# Altium project LSEL_PCB.PrjPcb
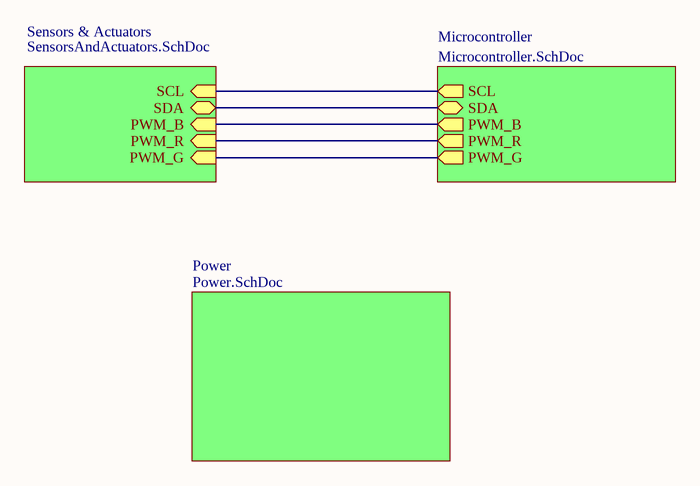
[diagram p0: General.SchDoc]
Project: LSEL PCB
4 sheets, 31 parts. Net scope: hierarchical (ports join the sheet entries above them; power ports are global).
Board file: LSEL_PCB.PcbDoc
Sheets:
  General.SchDoc
    Power = Power.SchDoc
    Microcontroller = Microcontroller.SchDoc
    Sensors & Actuators = SensorsAndActuators.SchDoc

## Sheet General.SchDoc
size A4; Date: *******; ApprovedBy: *******; CheckedBy: Dora; Author: *******; CompanyName: *******; DrawnBy: Loreto y Marcos; Engineer: *******; Organization: *******; Address1: *******; Address2: *******; Address3: *******; Address4: *******; DocumentNumber: 1; Revision: *******; SheetNumber: 1; SheetTotal: 4; CurrentTime: *******; CurrentDate: *******; Time: *******; DocumentFullPathAndName: *******; DocumentName: *******; ModifiedDate: *******; ImagePath: *******; ProjectName: *******; Application_BuildNumber: *******

### Sub-sheets
Microcontroller = Microcontroller.SchDoc: PWM_B (out), PWM_G (out), SDA (bidir), SCL (out), PWM_R (out)
Power = Power.SchDoc: no entries
Sensors & Actuators = SensorsAndActuators.SchDoc: SDA (bidir), PWM_B (in), SCL (in), PWM_R (in), PWM_G (in)

### Nets
NetR41_1: sheet Microcontroller/SDA, sheet Sensors & Actuators/SDA
NetR42_1: sheet Microcontroller/SCL, sheet Sensors & Actuators/SCL
NetR43_2: sheet Microcontroller/PWM_B, sheet Sensors & Actuators/PWM_B
NetR44_2: sheet Microcontroller/PWM_R, sheet Sensors & Actuators/PWM_R
NetR45_2: sheet Microcontroller/PWM_G, sheet Sensors & Actuators/PWM_G

### Notes on the sheet
- Title:
- Drawn By:
- Page Contents:
- Checked By:
- Size:
- Date:
- File:
- License:
- Email:
- A4
- Number:
- Time:
- Revision:
- Sheet
- Website:
- of

## Sheet Power.SchDoc
size A4; Date: *******; ApprovedBy: *******; CheckedBy: None; Author: *******; CompanyName: *******; DrawnBy: Name; Engineer: *******; Organization: *******; Address1: *******; Address2: *******; Address3: *******; Address4: *******; DocumentNumber: Doc Num; Revision: *******; SheetNumber: 2; SheetTotal: 4; CurrentTime: *******; CurrentDate: *******; Time: *******; DocumentFullPathAndName: *******; DocumentName: *******; ModifiedDate: *******; ImagePath: *******; ProjectName: *******; Application_BuildNumber: *******
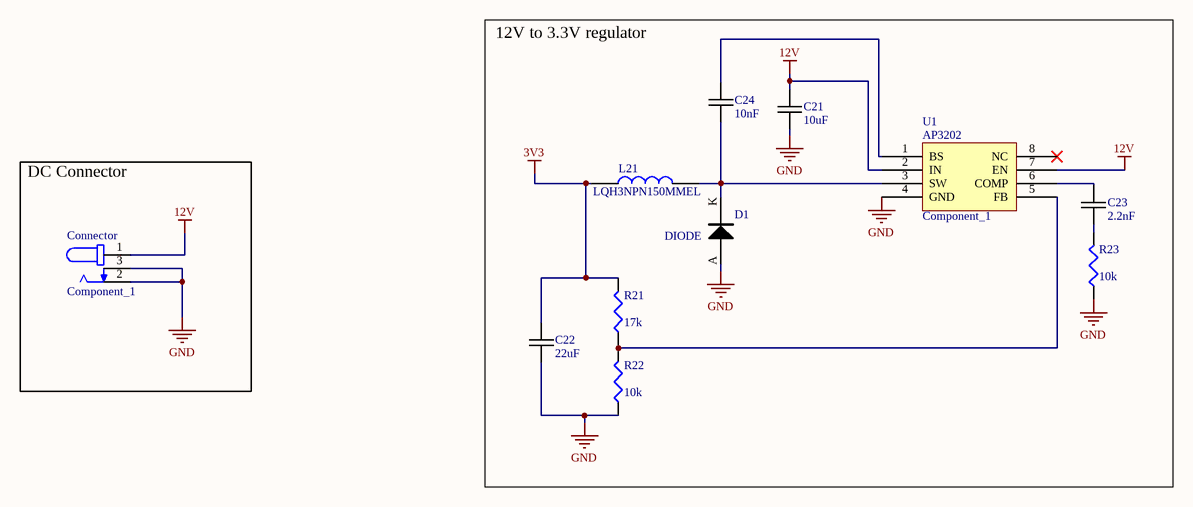
[diagram p1: Power.SchDoc]

### Parts
C21  10uF  [0603C-GENERIC]
C22  22uF  [0603C-GENERIC]
C23  2.2nF  [0603C-GENERIC]
C24  10nF  [0603C-GENERIC]
Connector  Component_1  [PCBComponent_1]
D1  DIODE  [RESC2012X65N]
L21  LQH3NPN150MMEL  [IND_LQH3NPH3R3MMEL]
R21  value 17k  [J1-0603]
R22  value 10k  [J1-0603]
R23  value 10k  [J1-0603]
U1  Component_1  [AP3202]

### Blocks framed on the sheet
12V to 3.3V regulator: C21-C24 D1 L21 R21-R23 U1
DC Connector: Connector

### Nets
3V3: C22.1 L21.1 R21.2
12V: C21.1 Connector.1 U1.2(IN) U1.7(EN)
GND: C21.2 C22.2 Connector.2 Connector.3 D1.A R22.1 R23.1 U1.4(GND)
NetC23_1: C23.1 U1.6(COMP)
NetC23_2: C23.2 R23.2
NetC24_1: C24.1 U1.1(BS)
NetC24_2: C24.2 D1.K L21.2 U1.3(SW)
NetR21_1: R21.1 R22.2 U1.5(FB)

Not connected (* = marked no-connect by the designer): U1 8(NC)*

### Notes on the sheet
- Title:
- Drawn By:
- Page Contents:
- Checked By:
- Size:
- Date:
- File:
- License:
- Email:
- A4
- Number:
- Time:
- Revision:
- Sheet
- Website:
- of
- (in symbol Component_1) AP3202

### Library data of the parts
C21-C24 = C0603-GENERIC: GENERIC CAPACITOR NON POLARISED 0603
D1 = DIODE-GENERIC: GENERIC DIODE
L21 = LQH3NPH3R3MMEL: Inductor with Inductance 3.3uH Tol.+/-20% Package 1212 (3030); MF: Murata; Check_prices: https://www.snapeda.com/parts/LQH3NPH3R3MMEL/Murata/view-part/4970388/?ref=eda; Digi-Key_Part_Number: 490-LQH3NPH3R3MMELCT-ND; Package: 1212 Murata; MP: LQH3NPH3R3MMEL; Value: *; SnapEDA_Link: https://www.snapeda.com/parts/LQH3NPH3R3MMEL/Murata/view-part/4970388/?ref=snap; Purchase-URL: https://pricing.snapeda.com/search/part/LQH3NPH3R3MMEL/?ref=eda
R21-R23 = Res3: Resistor; Published: 8-Jun-2000; LatestRevisionDate: 29-May-2009; LatestRevisionNote: IPC-7351 Footprint Added.; PackageReference: J1-0603; Publisher: Altium Limited; PackageDescription: Chip Resistor

## Sheet Microcontroller.SchDoc: Title
size A4; Date: *******; ApprovedBy: *******; CheckedBy: None; Author: *******; CompanyName: *******; DrawnBy: Name; Engineer: *******; Organization: *******; Address1: *******; Address2: *******; Address3: *******; Address4: *******; DocumentNumber: Doc Num; Revision: *******; SheetNumber: 3; SheetTotal: 4; CurrentTime: *******; CurrentDate: *******; Time: *******; DocumentFullPathAndName: *******; DocumentName: *******; ModifiedDate: *******; ImagePath: *******; ProjectName: *******; Application_BuildNumber: *******
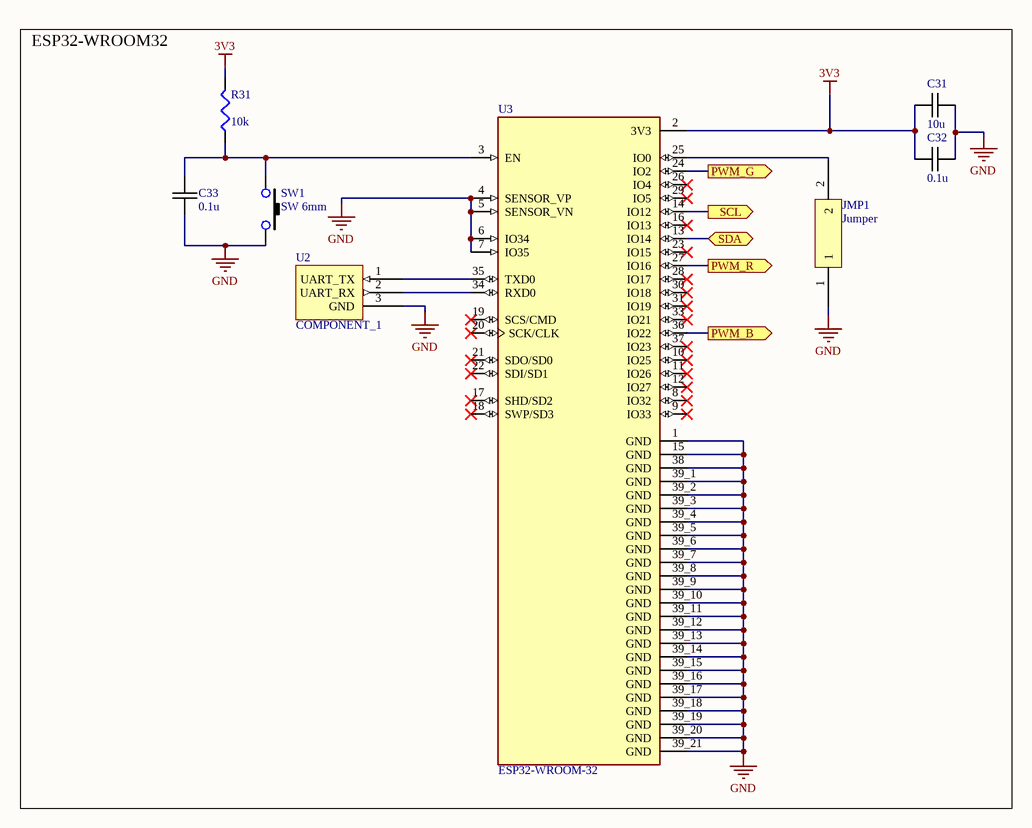
[diagram p2: Microcontroller.SchDoc]

### Parts
C31  10u  [0603C-GENERIC]
C32  0.1u  [0603C-GENERIC]
C33  0.1u  [0603C-GENERIC]
JMP1  Jumper  [jumper]
R31  value 10k  [J1-0603]
SW1  SW 6mm  [SW-PB-SMD]
U2  COMPONENT_1  [PCBComponent_1]
U3  ESP32-WROOM-32  [ESP32]

### Blocks framed on the sheet
ESP32-WROOM32: C31-C33 JMP1 R31 SW1 U2 U3

### Ports
PWM_B (out), PWM_G (out), PWM_R (out), SCL (out), SDA (bidir)

### Nets
3V3: C31.1 C32.1 R31.2 U3.2(3V3)
GND: C31.2 C32.2 C33.2 JMP1.1 SW1.2 U2.3(GND) U3.1(GND) U3.4(SENSOR_VP) U3.5(SENSOR_VN) U3.6(IO34) U3.7(IO35) U3.15(GND) U3.38(GND) U3.39_1(GND) U3.39_2(GND) U3.39_3(GND) U3.39_4(GND) U3.39_5(GND) U3.39_6(GND) U3.39_7(GND) U3.39_8(GND) U3.39_9(GND) U3.39_10(GND) U3.39_11(GND) U3.39_12(GND) U3.39_13(GND) U3.39_14(GND) U3.39_15(GND) U3.39_16(GND) U3.39_17(GND) U3.39_18(GND) U3.39_19(GND) U3.39_20(GND) U3.39_21(GND)
NetC33_1: C33.1 R31.1 SW1.1 U3.3(EN)
NetJMP1_2: JMP1.2 U3.25(IO0)
NetR41_1: U3.13(IO14) ; port SDA
NetR42_1: U3.14(IO12) ; port SCL
NetR43_2: U3.36(IO22) ; port PWM_B
NetR44_2: U3.27(IO16) ; port PWM_R
NetR45_2: U3.24(IO2) ; port PWM_G
NetU2_1: U2.1(UART_TX) U3.35(TXD0)
NetU2_2: U2.2(UART_RX) U3.34(RXD0)

Not connected (* = marked no-connect by the designer): U3 8(IO32)* 9(IO33)* 10(IO25)* 11(IO26)* 12(IO27)* 16(IO13)* 17(SHD/SD2)* 18(SWP/SD3)* 19(SCS/CMD)* 20(SCK/CLK)* 21(SDO/SD0)* 22(SDI/SD1)* 23(IO15)* 26(IO4)* 28(IO17)* 29(IO5)* 30(IO18)* 31(IO19)* 33(IO21)* 37(IO23)*

### Notes on the sheet
- Title:
- Drawn By:
- Page Contents:
- Checked By:
- Size:
- Date:
- File:
- License:
- Email:
- A4
- Number:
- Time:
- Revision:
- Sheet
- Website:
- of

### Library data of the parts
C31-C33 = C0603-GENERIC: GENERIC CAPACITOR NON POLARISED 0603
R31 = Res3: Resistor; Published: 8-Jun-2000; LatestRevisionDate: 29-May-2009; LatestRevisionNote: IPC-7351 Footprint Added.; PackageReference: J1-0603; Publisher: Altium Limited; PackageDescription: Chip Resistor
SW1 = SW-PB6MM-SMD: PUSHBUTTON SWITCH 6MM SMD
U3 = ESP32-WROOM-32: Bluetooth, WiFi Transceiver Module 2.4GHz ~ 2.5GHz Surface Mount; MF: Espressif Systems; Package: Module Espressif Systems; Digi-Key_Part_Number: 1904-1010-1-ND; Digi-Key_Purchase_URL: https://www.digikey.com/product-detail/en/espressif-systems/ESP32-WROOM-32/1904-1010-1-ND/8544305?utm_source=snapeda&utm_medium=aggregator&utm_campaign=symbol; Value: *; MP: ESP32-WROOM-32; SnapEDA_Link: https://www.snapeda.com/parts/ESP32-WROOM-32/Espressif%20Systems/view-part/2753322/?ref=snap

## Sheet SensorsAndActuators.SchDoc: Title
size A4; Date: *******; ApprovedBy: *******; CheckedBy: None; Author: *******; CompanyName: *******; DrawnBy: Name; Engineer: *******; Organization: *******; Address1: *******; Address2: *******; Address3: *******; Address4: *******; DocumentNumber: Doc Num; Revision: *******; SheetNumber: 4; SheetTotal: 4; CurrentTime: *******; CurrentDate: *******; Time: *******; DocumentFullPathAndName: *******; DocumentName: *******; ModifiedDate: *******; ImagePath: *******; ProjectName: *******; Application_BuildNumber: *******
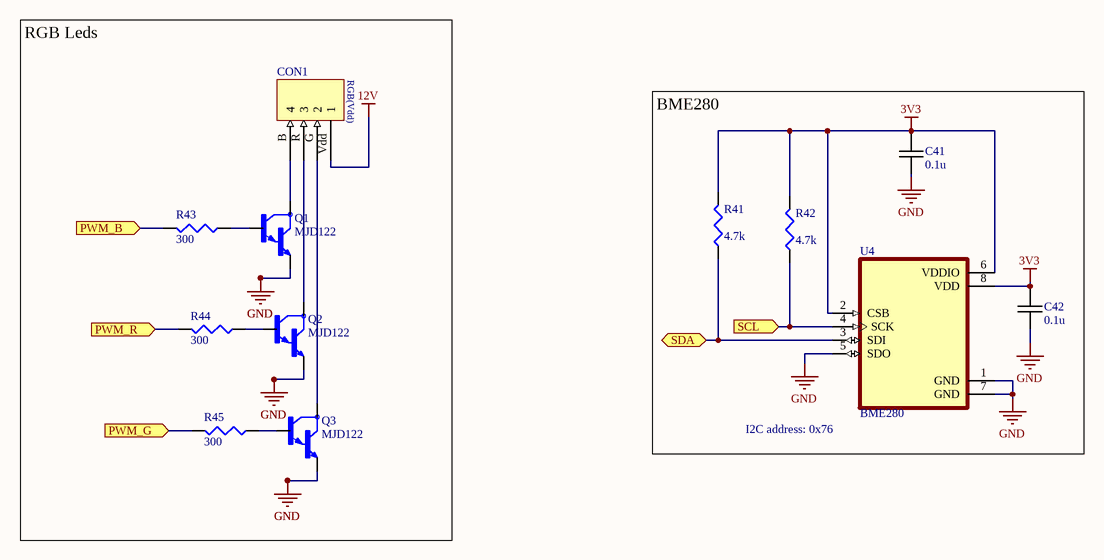
[diagram p3: SensorsAndActuators.SchDoc]

### Parts
C41  0.1u  [0603C-GENERIC]
C42  0.1u  [0603C-GENERIC]
CON1  (no value)  [PCBComponent_1]
Q1  MJD122  [MJD122]
Q2  MJD122  [MJD122]
Q3  MJD122  [MJD122]
R41  value 4.7k  [J1-0603]
R42  value 4.7k  [J1-0603]
R43  value 300  [J1-0603]
R44  value 300  [J1-0603]
R45  value 300  [J1-0603]
U4  BME280  [BME280]

### Blocks framed on the sheet
RGB Leds: CON1 Q1-Q3 R43-R45
BME280: C41 C42 R41 R42 U4

### Ports
PWM_B (in), PWM_G (in), PWM_R (in), SCL (in), SDA (bidir)

### Nets
3V3: C41.1 C42.1 R41.2 R42.2 U4.2(CSB) U4.6(VDDIO) U4.8(VDD)
12V: CON1.Vdd(1)
GND: C41.2 C42.2 Q1.3(E) Q2.3(E) Q3.3(E) U4.1(GND) U4.5(SDO) U4.7(GND)
NetCON1_B: CON1.B(4) Q1.4(C)
NetCON1_G: CON1.G(2) Q3.4(C)
NetCON1_R: CON1.R(3) Q2.4(C)
NetQ1_1: Q1.1(B) R43.1
NetQ2_1: Q2.1(B) R44.1
NetQ3_1: Q3.1(B) R45.1
NetR41_1: R41.1 U4.3(SDI) ; port SDA
NetR42_1: R42.1 U4.4(SCK) ; port SCL
NetR43_2: R43.2 ; port PWM_B
NetR44_2: R44.2 ; port PWM_R
NetR45_2: R45.2 ; port PWM_G

### Notes on the sheet
- (near U4) I2C address: 0x76
- Title:
- Drawn By:
- Page Contents:
- Checked By:
- Size:
- Date:
- File:
- License:
- Email:
- A4
- Number:
- Time:
- Revision:
- Sheet
- Website:
- of
- (in symbol Component_1) RGB(Vdd)

### Library data of the parts
C41 C42 = C0603-GENERIC: GENERIC CAPACITOR NON POLARISED 0603
CON1 = Component_1
Q1-Q3 = MJD122: Bipolar _BJT_ Transistor NPN - Darlington 100V 8A 4MHz 1.75W Surface Mount DPAK; MF: ON Semiconductor; Availability: Unavailable; Package: TO-252 ON Semiconductor; MP: MJD122; Value: *; SnapEDA_Link: https://www.snapeda.com/parts/MJD122/ON%20Semiconductor/view-part/4705673/?ref=snap; Price: None
R41-R45 = Res3: Resistor; Published: 8-Jun-2000; LatestRevisionDate: 29-May-2009; LatestRevisionNote: IPC-7351 Footprint Added.; PackageReference: J1-0603; Publisher: Altium Limited; PackageDescription: Chip Resistor
U4 = BME280: Humidity Temperature Sensor 0 ~ 100% RH IÂ²C, SPI Â±3% 1s Surface Mount; MF: Bosch; Price: None; Package: LGA-8 Bosch; Value: *; MP: BME280; Availability: Unavailable; SnapEDA_Link: https://www.snapeda.com/parts/BME280/Bosch%20Sensortec/view-part/49769/?ref=snap

## Nets that join several sheets
3V3: Power (C22.1 L21.1 R21.2), Microcontroller (C31.1 C32.1 R31.2 U3.2), SensorsAndActuators (7 pins)
12V: Power (C21.1 Connector.1 U1.2 U1.7), SensorsAndActuators (CON1.Vdd)
GND: Power (8 pins), Microcontroller (34 pins), SensorsAndActuators (8 pins)
NetR41_1: Microcontroller (U3.13), SensorsAndActuators (R41.1 U4.3)
NetR42_1: Microcontroller (U3.14), SensorsAndActuators (R42.1 U4.4)
NetR43_2: Microcontroller (U3.36), SensorsAndActuators (R43.2)
NetR44_2: Microcontroller (U3.27), SensorsAndActuators (R44.2)
NetR45_2: Microcontroller (U3.24), SensorsAndActuators (R45.2)